# Altium project RoboMate.PrjPcb
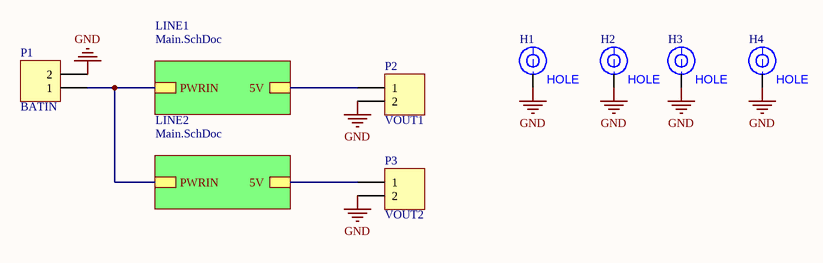
[diagram p0: Top.SchDoc]
2 sheets, 43 parts. Net scope: hierarchical (ports join the sheet entries above them; power ports are global).
Board file: RoboMate.PcbDoc
Sheets:
  Top.SchDoc
    LINE1 = Main.SchDoc
    LINE2 = Main.SchDoc

## Sheet Top.SchDoc
size A4

### Parts
H1  (no value)  [铜柱-M2]
H2  (no value)  [铜柱-M2]
H3  (no value)  [铜柱-M2]
H4  (no value)  [铜柱-M2]
P1  BATIN  [XT30-HF - HALF]
P2  VOUT1  [XT30-HF - HALF]
P3  VOUT2  [XT30-HF - HALF]

### Sub-sheets
LINE1 = Main.SchDoc: 5V, PWRIN
LINE2 = Main.SchDoc: 5V, PWRIN

### Nets
GND: H1.0 H2.0 H3.0 H4.0 P1.2 P2.2 P3.2
NetC2_LINE1_2: P2.1 ; sheet LINE1/5V
NetC2_LINE2_2: P3.1 ; sheet LINE2/5V
NetC5_LINE1_2: P1.1 ; sheet LINE1/PWRIN, sheet LINE2/PWRIN

### Library data of the parts
H1-H4 = HOLE
P1-P3 = Header 2: Header, 2-Pin; LatestRevisionDate: 17-Jul-2002; LatestRevisionNote: Re-released for DXP Platform.; Publisher: Altium Limited

## Sheet Main.SchDoc
size A4
Used 2 times, as channels LINE1, LINE2. Parts and nets are listed once, with the designators drawn on the sheet.
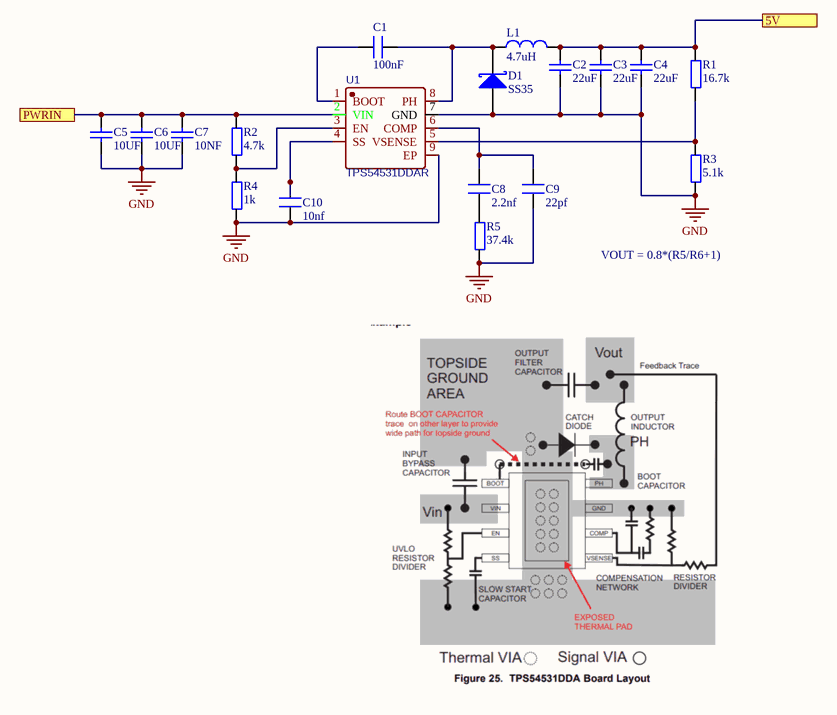
[diagram p1: Main.SchDoc]

### Parts
C1  100nF  [C 0603]
C2  22uF  [1206-C]
C3  22uF  [1206-C]
C4  22uF  [1206-C]
C5  10UF  [1206-C]
C6  10UF  [1206-C]
C7  10NF  [1206-C]
C8  2.2nf  [C 0603]
C9  22pf  [C 0603]
C10  10nf  [C 0603]
D1  SS35  [SMC_L6.9-W5.9-LS7.9-RD]
L1  4.7uH  [L-CDRH74R]
R1  16.7k  [R 0603]
R2  4.7k  [R 0603]
R3  5.1k  [R 0603]
R4  1k  [R 0603]
R5  37.4k  [R 0603]
U1  TPS54531DDAR  [SOIC-8_L5.0-W4.0-P1.27-LS6.0-BL-EP]

### Ports
5V, PWRIN

### Nets
GND: C2.1 C3.1 C4.1 C5.1 C6.1 C7.1 C9.1 C10.1 D1.1(A) R3.1 R4.1 R5.1 U1.7(GND) U1.9(EP)
5V: C2.2 C3.2 C4.2 L1.2 R1.2 ; port 5V
PWRIN: C5.2 C6.2 C7.2 R2.2 U1.2(VIN) ; port PWRIN
NetC1_1: C1.1 D1.2(K) L1.1 U1.8(PH)
NetC1_2: C1.2 U1.1(BOOT)
NetC8_1: C8.1 R5.2
NetC8_2: C8.2 C9.2 U1.6(COMP)
NetC10_2: C10.2 U1.4(SS)
NetR1_1: R1.1 R3.2 U1.5(VSENSE)
NetR2_1: R2.1 R4.2 U1.3(EN)

### Channels
LINE1: designators end in _LINE1; ports 5V=NetC2_LINE1_2 PWRIN=NetC5_LINE1_2
LINE2: designators end in _LINE2; ports 5V=NetC2_LINE2_2 PWRIN=NetC5_LINE1_2

### Notes on the sheet
- VOUT = 0.8*(R5/R6+1)

### Library data of the parts
C1 C8-C10 = C
C2-C7 = CAP: 陶瓷电容
D1 = D Schottky: Schottky Diode; Published: 8-Jun-2000; LatestRevisionDate: 17-Jul-2002; LatestRevisionNote: Re-released for DXP Platform.; PackageReference: SMB; Publisher: Altium Limited; Code_JEDEC: DO-214-AA
L1 = INDUCTOR-SMD: 贴片屏蔽电感
R1-R5 = R
U1 = TPS54531DDAR: BOM_Manufacturer: TI; BOM_Manufacturer Part: TPS79333DBVR; SMT Type: Extend; spicePre: X; BOM_Supplier: LCSC; image: //image.lceda.cn/szlcsc/C9840.jpg; BOM_Supplier Part: C9840; BOM_LCSC Assembly: Yes; spiceSymbolName: TPS79333DBVR

## Nets that join several sheets
GND: Top (7 pins), LINE1 (14 pins), LINE2 (14 pins)
NetC2_LINE1_2: Top (P2.1), LINE1 (5 pins)
NetC2_LINE2_2: Top (P3.1), LINE2 (5 pins)
NetC5_LINE1_2: Top (P1.1), LINE1 (5 pins), LINE2 (5 pins)